# Altium project pwr8.PrjPcb
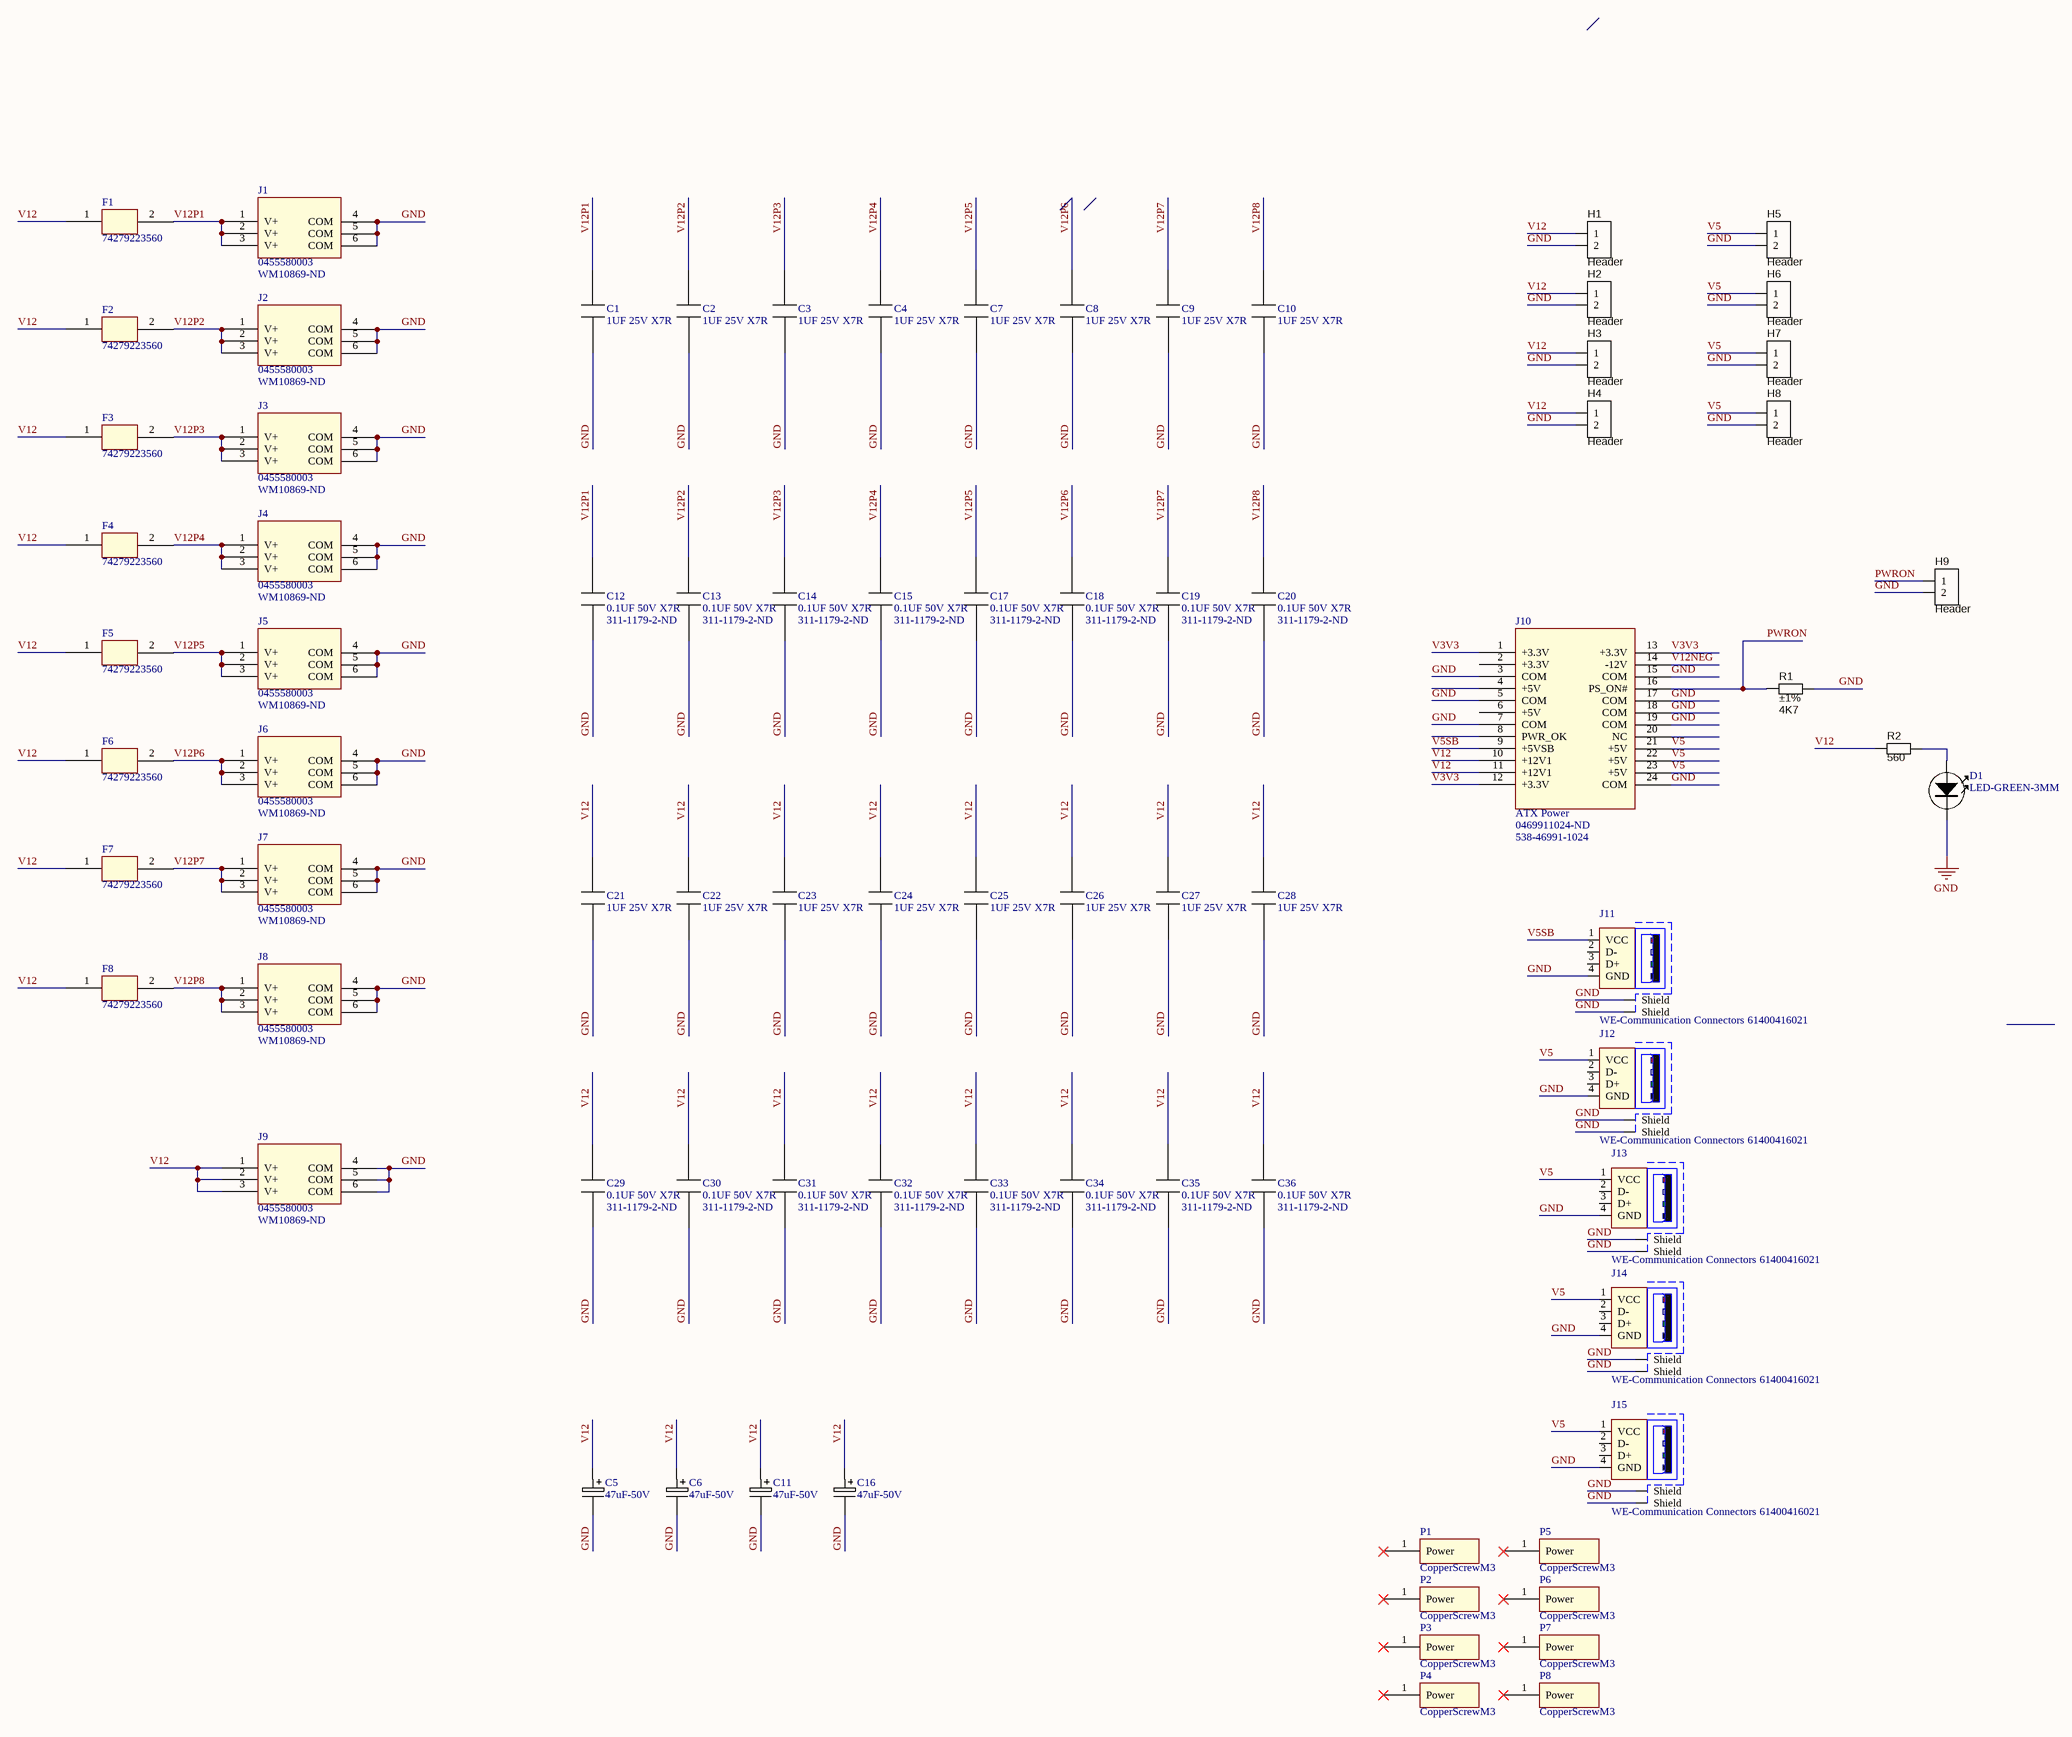
[diagram p0: Sheet0_Top.SchDoc]
1 sheet, 79 parts. Net scope: global (net labels, ports and power ports of the same name join across sheets).
Board file: PWR8.PcbDoc

## Sheet Sheet0_Top.SchDoc
size C

### Parts
C1  1UF 25V X7R  [C1206YageoX7R]
C2  1UF 25V X7R  [C1206YageoX7R]
C3  1UF 25V X7R  [C1206YageoX7R]
C4  1UF 25V X7R  [C1206YageoX7R]
C5  47uF-50V  [PANACAP-E-GENERIC]
C6  47uF-50V  [PANACAP-E-GENERIC]
C7  1UF 25V X7R  [C1206YageoX7R]
C8  1UF 25V X7R  [C1206YageoX7R]
C9  1UF 25V X7R  [C1206YageoX7R]
C10  1UF 25V X7R  [C1206YageoX7R]
C11  47uF-50V  [PANACAP-E-GENERIC]
C12  0.1UF 50V X7R  Supplier Part Number 1: 311-1179-2-ND  [C1206YageoX7R]
C13  0.1UF 50V X7R  Supplier Part Number 1: 311-1179-2-ND  [C1206YageoX7R]
C14  0.1UF 50V X7R  Supplier Part Number 1: 311-1179-2-ND  [C1206YageoX7R]
C15  0.1UF 50V X7R  Supplier Part Number 1: 311-1179-2-ND  [C1206YageoX7R]
C16  47uF-50V  [PANACAP-E-GENERIC]
C17  0.1UF 50V X7R  Supplier Part Number 1: 311-1179-2-ND  [C1206YageoX7R]
C18  0.1UF 50V X7R  Supplier Part Number 1: 311-1179-2-ND  [C1206YageoX7R]
C19  0.1UF 50V X7R  Supplier Part Number 1: 311-1179-2-ND  [C1206YageoX7R]
C20  0.1UF 50V X7R  Supplier Part Number 1: 311-1179-2-ND  [C1206YageoX7R]
C21  1UF 25V X7R  [C1206YageoX7R]
C22  1UF 25V X7R  [C1206YageoX7R]
C23  1UF 25V X7R  [C1206YageoX7R]
C24  1UF 25V X7R  [C1206YageoX7R]
C25  1UF 25V X7R  [C1206YageoX7R]
C26  1UF 25V X7R  [C1206YageoX7R]
C27  1UF 25V X7R  [C1206YageoX7R]
C28  1UF 25V X7R  [C1206YageoX7R]
C29  0.1UF 50V X7R  Supplier Part Number 1: 311-1179-2-ND  [C1206YageoX7R]
C30  0.1UF 50V X7R  Supplier Part Number 1: 311-1179-2-ND  [C1206YageoX7R]
C31  0.1UF 50V X7R  Supplier Part Number 1: 311-1179-2-ND  [C1206YageoX7R]
C32  0.1UF 50V X7R  Supplier Part Number 1: 311-1179-2-ND  [C1206YageoX7R]
C33  0.1UF 50V X7R  Supplier Part Number 1: 311-1179-2-ND  [C1206YageoX7R]
C34  0.1UF 50V X7R  Supplier Part Number 1: 311-1179-2-ND  [C1206YageoX7R]
C35  0.1UF 50V X7R  Supplier Part Number 1: 311-1179-2-ND  [C1206YageoX7R]
C36  0.1UF 50V X7R  Supplier Part Number 1: 311-1179-2-ND  [C1206YageoX7R]
D1  LED-GREEN-3MM  [LED-3MM-GREEN]
F1  74279223560  [74279223560]
F2  74279223560  [74279223560]
F3  74279223560  [74279223560]
F4  74279223560  [74279223560]
F5  74279223560  [74279223560]
F6  74279223560  [74279223560]
F7  74279223560  [74279223560]
F8  74279223560  [74279223560]
H1  Header  [HDR_1x2_Offset]  (no BOM)
H2  Header  [HDR_1x2_Offset]  (no BOM)
H3  Header  [HDR_1x2_Offset]  (no BOM)
H4  Header  [HDR_1x2_Offset]  (no BOM)
H5  Header  [HDR_1x2_Offset]  (no BOM)
H6  Header  [HDR_1x2_Offset]  (no BOM)
H7  Header  [HDR_1x2_Offset]  (no BOM)
H8  Header  [HDR_1x2_Offset]  (no BOM)
H9  Header  [HDR_1x2_Offset]  (no BOM)
J1  0455580003  Supplier Part Number 1: WM10869-ND  [45558]
J2  0455580003  Supplier Part Number 1: WM10869-ND  [45558]
J3  0455580003  Supplier Part Number 1: WM10869-ND  [45558]
J4  0455580003  Supplier Part Number 1: WM10869-ND  [45558]
J5  0455580003  Supplier Part Number 1: WM10869-ND  [45558]
J6  0455580003  Supplier Part Number 1: WM10869-ND  [45558]
J7  0455580003  Supplier Part Number 1: WM10869-ND  [45558]
J8  0455580003  Supplier Part Number 1: WM10869-ND  [45558]
J9  0455580003  Supplier Part Number 1: WM10869-ND  [45558]
J10  ATX Power  Supplier Part Number 1: 0469911024-ND  Supplier Part Number 2: 538-46991-1024  [46991-1024]
J11  WE-Communication Connectors 61400416021  [61400416021]
J12  WE-Communication Connectors 61400416021  [61400416021]
J13  WE-Communication Connectors 61400416021  [61400416021]
J14  WE-Communication Connectors 61400416021  [61400416021]
J15  WE-Communication Connectors 61400416021  [61400416021]
P1  CopperScrewM3  [M3Screw]
P2  CopperScrewM3  [M3Screw]
P3  CopperScrewM3  [M3Screw]
P4  CopperScrewM3  [M3Screw]
P5  CopperScrewM3  [M3Screw]
P6  CopperScrewM3  [M3Screw]
P7  CopperScrewM3  [M3Screw]
P8  CopperScrewM3  [M3Screw]
R1  value 4K7  Tolerance: ±1%  [RESC1005X40N]  (hidden comment: Thick Film)
R2  value 560  [RESC3216X70N]  (hidden comment: 560 Ohm .25 1206)

### Nets
GND: C1.2 C2.2 C3.2 C4.2 C5.- C6.- C7.2 C8.2 C9.2 C10.2 C11.- C12.1 C13.1 C14.1 C15.1 C16.- C17.1 C18.1 C19.1 C20.1 C21.2 C22.2 C23.2 C24.2 C25.2 C26.2 C27.2 C28.2 C29.1 C30.1 C31.1 C32.1 C33.1 C34.1 C35.1 C36.1 D1.K H1.2 H2.2 H3.2 H4.2 H5.2 H6.2 H7.2 H8.2 H9.2 J1.4(COM) J1.5(COM) J1.6(COM) J2.4(COM) J2.5(COM) J2.6(COM) J3.4(COM) J3.5(COM) J3.6(COM) J4.4(COM) J4.5(COM) J4.6(COM) J5.4(COM) J5.5(COM) J5.6(COM) J6.4(COM) J6.5(COM) J6.6(COM) J7.4(COM) J7.5(COM) J7.6(COM) J8.4(COM) J8.5(COM) J8.6(COM) J9.4(COM) J9.5(COM) J9.6(COM) J10.3(COM) J10.5(COM) J10.7(COM) J10.15(COM) J10.17(COM) J10.18(COM) J10.19(COM) J10.24(COM) J11.4(GND) J11.Z1(Shield) J11.Z2(Shield) J12.4(GND) J12.Z1(Shield) J12.Z2(Shield) J13.4(GND) J13.Z1(Shield) J13.Z2(Shield) J14.4(GND) J14.Z1(Shield) J14.Z2(Shield) J15.4(GND) J15.Z1(Shield) J15.Z2(Shield) R1.2
PWRON: H9.1 J10.16(PS_ON#) R1.1
V3V3: J10.1(+3.3V) J10.12(+3.3V) J10.13(+3.3V)
V5: H5.1 H6.1 H7.1 H8.1 J10.21(+5V) J10.22(+5V) J10.23(+5V) J12.1(VCC) J13.1(VCC) J14.1(VCC) J15.1(VCC)
V5SB: J10.9(+5VSB) J11.1(VCC)
V12: C5.+ C6.+ C11.+ C16.+ C21.1 C22.1 C23.1 C24.1 C25.1 C26.1 C27.1 C28.1 C29.2 C30.2 C31.2 C32.2 C33.2 C34.2 C35.2 C36.2 F1.1 F2.1 F3.1 F4.1 F5.1 F6.1 F7.1 F8.1 H1.1 H2.1 H3.1 H4.1 J9.1(V+) J9.2(V+) J9.3(V+) J10.10(+12V1) J10.11(+12V1) R2.1
V12NEG: J10.14(-12V)
V12P1: C1.1 C12.2 F1.2 J1.1(V+) J1.2(V+) J1.3(V+)
V12P2: C2.1 C13.2 F2.2 J2.1(V+) J2.2(V+) J2.3(V+)
V12P3: C3.1 C14.2 F3.2 J3.1(V+) J3.2(V+) J3.3(V+)
V12P4: C4.1 C15.2 F4.2 J4.1(V+) J4.2(V+) J4.3(V+)
V12P5: C7.1 C17.2 F5.2 J5.1(V+) J5.2(V+) J5.3(V+)
V12P6: C8.1 C18.2 F6.2 J6.1(V+) J6.2(V+) J6.3(V+)
V12P7: C9.1 C19.2 F7.2 J7.1(V+) J7.2(V+) J7.3(V+)
V12P8: C10.1 C20.2 F8.2 J8.1(V+) J8.2(V+) J8.3(V+)
NetD1_A: D1.A R2.2

Not connected (* = marked no-connect by the designer): J10 2(+3.3V) 4(+5V) 6(+5V) 8(PWR_OK) 20(NC); J11 2(D-) 3(D+); J12 2(D-) 3(D+); J13 2(D-) 3(D+); J14 2(D-) 3(D+); J15 2(D-) 3(D+); P1 1(Power)*; P2 1(Power)*; P3 1(Power)*; P4 1(Power)*; P5 1(Power)*; P6 1(Power)*; P7 1(Power)*; P8 1(Power)*

### Library data of the parts
C1-C4 C7-C10 C21-C28 = CC1206KKX7R8BB105: CAP CER 1UF 25V X7R 1206 Yageo CC1206KKX7R8BB105; Supplier 1: Digi-Key; Supplier Part Number 1: 311-1356-2-ND
C5 C6 C11 C16 = PANACAP-47UF-50V-FK: GENERIC CAPACITOR POLARISED; Supplier 1: Digi-Key; Supplier Part Number 1: PCE3816TR-ND
C12-C15 C17-C20 C29-C36 = CC1206KRX7R9BB104: CAP CER 0.1UF 50V X7R 1206 YAGEO CC1206KRX7R9BB104; Supplier 1: Digi-Key
F1-F8 = 74279223560: Wurth 74279223560 Ferrite Bead 4000 uohm 10Amps
H1-H9 = Header2P: Header, 2-pin
J10 = 46991-2024: Mini-Fit JR LCP RA HDR NOPEG 24C; Supplier 1: Digi-Key; Supplier 2: Mouser
J11-J15 = WE-Communication Connectors 61400416021: WR-COM USB RA Type A; Manufacturer: Würth Elektronik eiSos GmbH; ComponentLink1 Description: Manufacturer; ComponentLink2 Description: Datasheet; NoPins: 4; ComponentLink1URL: http://www.we-online.de; ComponentLink2URL: http://katalog.we-online.de/em/datasheet/61400416021.pdf; Created by: Karrer Zheng; Created Date: 10/10/2014; partNo: 61400416021
R1 = RES_4K7_0402_1%: Resistor SMD chip 4.7K Ohm 0.1W 1% 0402; Manufacturer: Yageo; Manufacturer Part Number: RC0603FR-074K7L; Ratings: 1/10W; SCDType: undef; Package / Case: 0603 (1608 Metric); Supplier 1: Digi-Key; Supplier Part Number 1: YAG1272TR-ND
R2 = RC1206JR-07560RL: Resistor, SMD chip RC1206JR-07560RL RES SMD 560 OHM 5% 1/4W 1206; Package / Case: 1206 (3216 metric)
J1-J9 = 0455580003: Supplier 1: Digi-Key